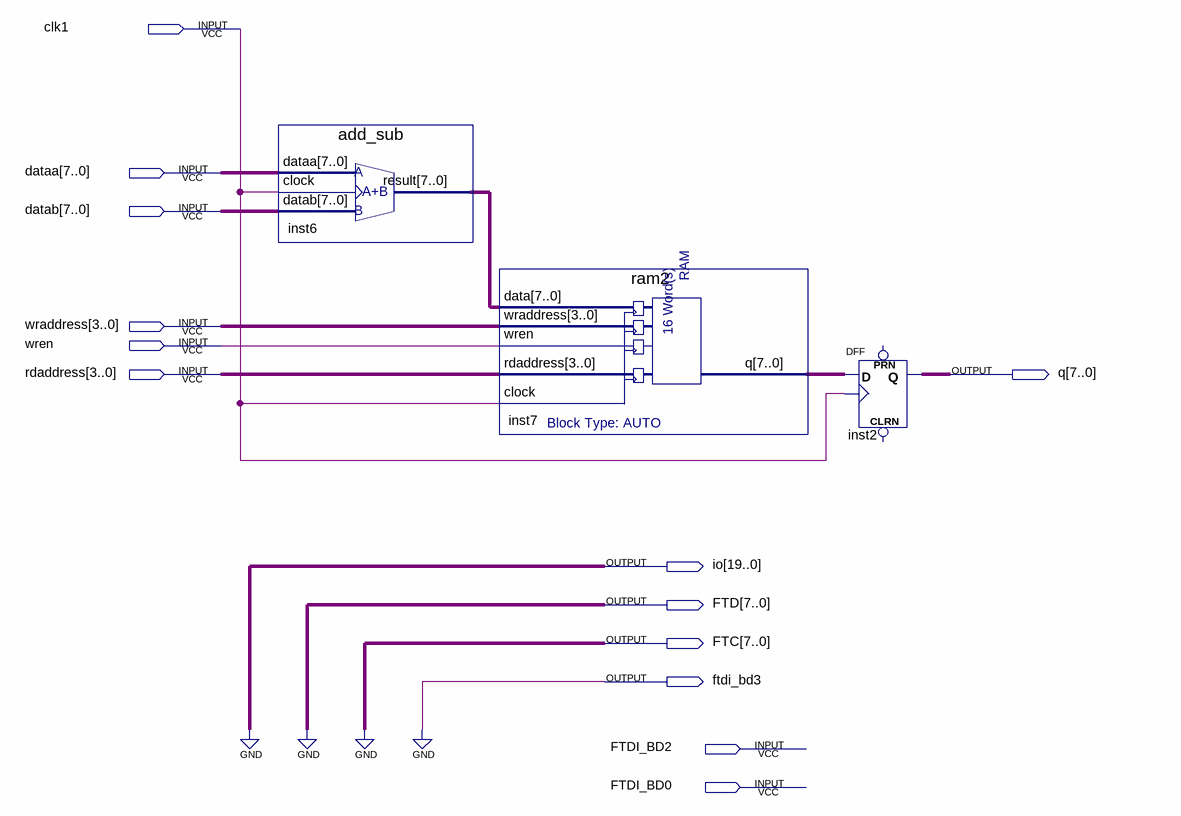
[diagram p0: schematic sheet]
// Quartus schematic pipeadd.bdf as structural Verilog: 3 symbols, 13 pins
module pipeadd (
  input  clk1,
  input  [7:0] dataa,
  input  [7:0] datab,
  input  [3:0] wraddress,
  input  wren,
  input  [3:0] rdaddress,
  input  FTDI_BD2,
  input  FTDI_BD0,
  output [7:0] q,
  output [19:0] io,
  output [7:0] FTD,
  output [7:0] FTC,
  output ftdi_bd3
);

  wire [7:0] inst6_result, inst7_q;

  add_sub inst6 (.dataa(dataa), .datab(datab), .clock(clk1), .result(inst6_result));
  ram2 inst7 (
    .data(inst6_result), .wraddress(wraddress), .wren(wren), .rdaddress(rdaddress), .clock(clk1), .q(inst7_q));
  DFF inst2[7:0] (.CLK(clk1), .D(inst7_q), .Q(q));  // open: CLRN, PRN

  assign FTC = {8{1'b0}};
  assign FTD = {8{1'b0}};
  assign ftdi_bd3 = 1'b0;
  assign io = {20{1'b0}};
endmodule
